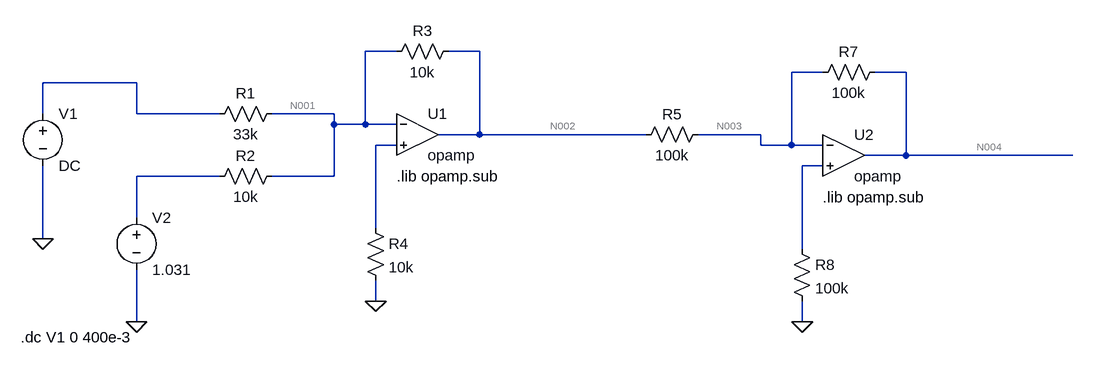
[diagram p0: schematic VCO_tuning_network.asc]
VCO_tuning_network.asc, the LTspice schematic file:
Version 4
SHEET 1 1236 680
WIRE 192 -16 144 -16
WIRE 320 -16 272 -16
WIRE 848 16 800 16
WIRE 976 16 928 16
WIRE -208 32 -352 32
WIRE -352 80 -352 32
WIRE -208 80 -208 32
WIRE -80 80 -208 80
WIRE 96 80 0 80
WIRE 96 96 96 80
WIRE 144 96 144 -16
WIRE 144 96 96 96
WIRE 192 96 144 96
WIRE 320 112 320 -16
WIRE 320 112 256 112
WIRE 576 112 320 112
WIRE 752 112 656 112
WIRE 192 128 160 128
WIRE 752 128 752 112
WIRE 800 128 800 16
WIRE 800 128 752 128
WIRE 848 128 800 128
WIRE 976 144 976 16
WIRE 976 144 912 144
WIRE 1232 144 976 144
WIRE 848 160 816 160
WIRE -80 176 -208 176
WIRE 96 176 96 96
WIRE 96 176 0 176
WIRE -208 240 -208 176
WIRE 160 256 160 128
WIRE -352 272 -352 160
WIRE 816 288 816 160
WIRE 160 368 160 336
WIRE -208 400 -208 320
WIRE 816 400 816 368
FLAG -352 272 0
FLAG -208 400 0
FLAG 160 368 0
FLAG 816 400 0
SYMBOL res 16 64 R90
WINDOW 0 0 56 VBottom 2
WINDOW 3 32 56 VTop 2
SYMATTR InstName R1
SYMATTR Value 33k
SYMBOL res 16 160 R90
WINDOW 0 0 56 VBottom 2
WINDOW 3 32 56 VTop 2
SYMATTR InstName R2
SYMATTR Value 10k
SYMBOL res 288 -32 R90
WINDOW 0 0 56 VBottom 2
WINDOW 3 32 56 VTop 2
SYMATTR InstName R3
SYMATTR Value 10k
SYMBOL voltage -352 64 R0
SYMATTR InstName V1
SYMATTR Value DC
SYMBOL voltage -208 224 R0
SYMATTR InstName V2
SYMATTR Value 1.031
SYMBOL res 144 240 R0
SYMATTR InstName R4
SYMATTR Value 10k
SYMBOL Opamps\\opamp 224 48 R0
SYMATTR InstName U1
SYMBOL res 672 96 R90
WINDOW 0 0 56 VBottom 2
WINDOW 3 32 56 VTop 2
SYMATTR InstName R5
SYMATTR Value 100k
SYMBOL res 944 0 R90
WINDOW 0 0 56 VBottom 2
WINDOW 3 32 56 VTop 2
SYMATTR InstName R7
SYMATTR Value 100k
SYMBOL res 800 272 R0
SYMATTR InstName R8
SYMATTR Value 100k
SYMBOL Opamps\\opamp 880 80 R0
SYMATTR InstName U2
TEXT -386 424 Left 2 !.dc V1 0 400e-3
TEXT 192 176 Left 2 !.lib opamp.sub
TEXT 848 208 Left 2 !.lib opamp.sub

The netlist it stands for:
* VCO_tuning_network.asc
R1 N001 N005 33k
R2 N001 N008 10k
R3 N002 N001 10k
V1 N005 0 DC
V2 N008 0 1.031
R4 N006 0 10k
XU1 N001 N006 N002 opamp Aol=100K GBW=10Meg  ; pins invin noninvin out
R5 N003 N002 100k
R7 N004 N003 100k
R8 N007 0 100k
XU2 N003 N007 N004 opamp Aol=100K GBW=10Meg  ; pins invin noninvin out
.dc V1 0 400e-3
.lib opamp.sub
.lib opamp.sub
.backanno
.end

* Results of the author's LTspice run, read from the files saved beside the schematic
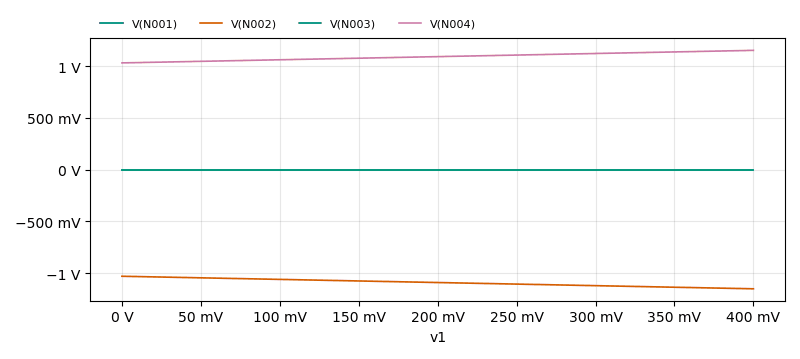
[diagram p1: DC transfer characteristic of VCO_tuning_network.asc, plotted from the saved traces]
* DC transfer characteristic, 1 run:
*   V(N001): 10.31 µV at v1=0 V, 11.52 µV at v1=400 mV, min 10.31 µV, max 11.52 µV
*   V(N002): -1.031 V at v1=0 V, -1.152 V at v1=400 mV, min -1.152 V, max -1.031 V
*   V(N003): -10.31 µV at v1=0 V, -11.52 µV at v1=400 mV, min -11.52 µV, max -10.31 µV
*   V(N004): 1.031 V at v1=0 V, 1.152 V at v1=400 mV, min 1.031 V, max 1.152 V